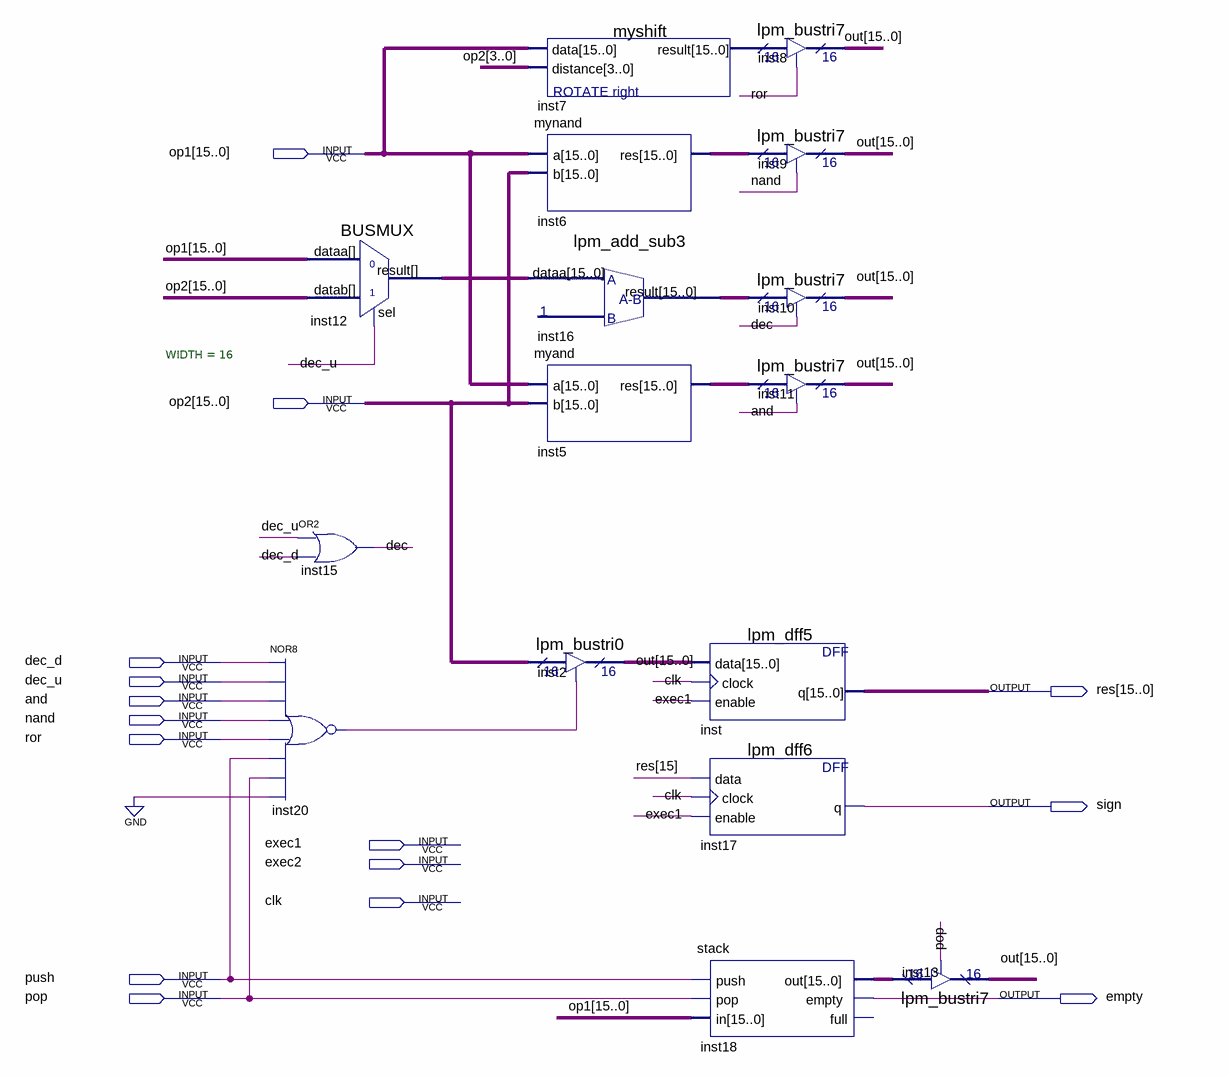
[diagram p0: schematic sheet]
// Quartus schematic alu.bdf as structural Verilog: 16 symbols, 15 pins
module alu (
  input  [15:0] op1,
  input  [15:0] op2,
  input  dec_d,
  input  dec_u,
  input  \and ,
  input  \nand ,
  input  ror,
  input  exec1,
  input  exec2,
  input  clk,
  input  push,
  input  pop,
  output [15:0] res,
  output sign,
  output empty
);

  wire dec, inst20_out;
  wire [15:0] inst5_res, inst6_res, inst7_result, inst12_result, inst16_result, inst18_out, out;

  BUSMUX #(.WIDTH(16)) inst12 (.datab(op2), .sel(dec_u), .dataa(op1), .result(inst12_result));
  or inst15 (dec, dec_u, dec_d);
  nor inst20 (inst20_out, dec_d, dec_u, \and , \nand , ror, push, pop, 1'b0);
  myshift inst7 (.data(op1), .distance(op2[3:0]), .result(inst7_result));
  mynand inst6 (.a(op1), .b(op2), .res(inst6_res));
  lpm_add_sub3 inst16 (.dataa(inst12_result), .result(inst16_result));
  myand inst5 (.a(op1), .b(op2), .res(inst5_res));
  lpm_bustri0 inst2 (.enabledt(inst20_out), .data(op2), .tridata(out));
  lpm_dff5 inst (.data(out), .clock(clk), .enable(exec1), .q(res));
  lpm_dff6 inst17 (.data(res[15]), .clock(clk), .enable(exec1), .q(sign));
  stack inst18 (.push(push), .pop(pop), .in(op1), .out(inst18_out), .empty(empty));  // open: full
  lpm_bustri7 inst8 (.enabledt(ror), .data(inst7_result), .tridata(out));
  lpm_bustri7 inst9 (.enabledt(\nand ), .data(inst6_res), .tridata(out));
  lpm_bustri7 inst10 (.enabledt(dec), .data(inst16_result), .tridata(out));
  lpm_bustri7 inst11 (.enabledt(\and ), .data(inst5_res), .tridata(out));
  lpm_bustri7 inst13 (.enabledt(pop), .data(inst18_out), .tridata(out));
endmodule
